# Altium project relay_snippet.PrjPCB
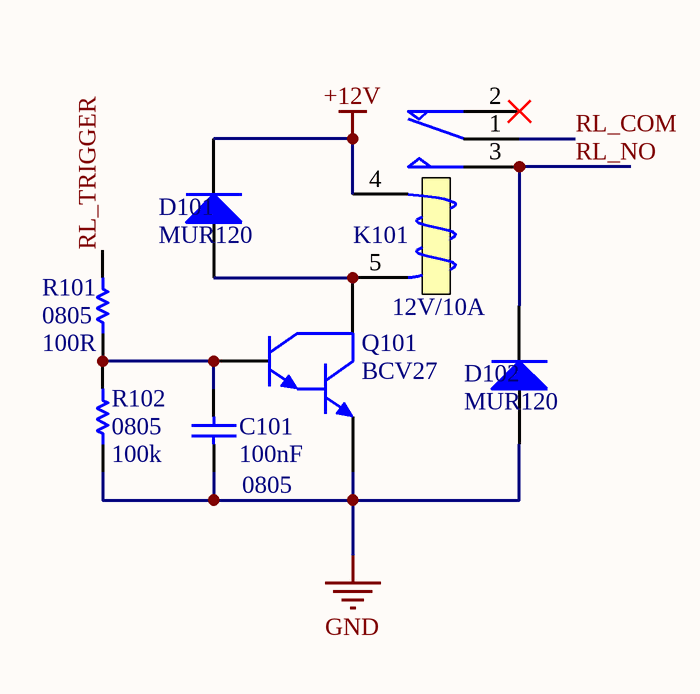
[diagram p0: relay.SchDoc]
1 sheet, 7 parts. Net scope: global (net labels, ports and power ports of the same name join across sheets).
Board file: relay.PcbDoc

## Sheet relay.SchDoc
size A

### Parts
C101  100nF  Footprint: 0805  [0805C]
D101  MUR120  [DIO10.2-7x2.7]
D102  MUR120  [DSO-C2/X2.3]
K101  12V/10A  [RELE]
Q101  BCV27  [SOT95P240-3N]
R101  0805  value 100R  [0805C]
R102  0805  value 100k  [0805C]

### Nets
+12V: D101.2(K) K101.4(T1)
GND: C101.1 D102.1(A) Q101.3(E) R102.1
RL_COM: K101.1(COM)
RL_NO: D102.2(K) K101.3(NO)
RL_TRIGGER: R101.2
NetC101_2: C101.2 Q101.2(B) R101.1 R102.2
NetD101_1: D101.1(A) K101.5(T2) Q101.1(C)

Not connected (* = marked no-connect by the designer): K101 2(NC)*

### Library data of the parts
C101 = Cap: Capacitor; Voltage: 25V; Type: pth; LatestRevisionNote: Re-released for DXP Platform.; PackageReference: RAD-0.3; Value: 100nF
D101 D102 = Diode: Default Diode; Type: pth; LatestRevisionNote: Re-released for DXP Platform.; PackageReference: SMC
K101 = Relay: SPDT Relay; LatestRevisionNote: Re-released for DXP Platform.; PackageReference: MODULE5B
Q101 = NPN1: NPN Darlington Bipolar Transistor; LatestRevisionNote: Re-released for DXP Platform.; PackageReference: TO-92
R101 R102 = Res1: Resistor; LatestRevisionNote: Re-released for DXP Platform.; PackageReference: AXIAL-0.3; Type: 0805